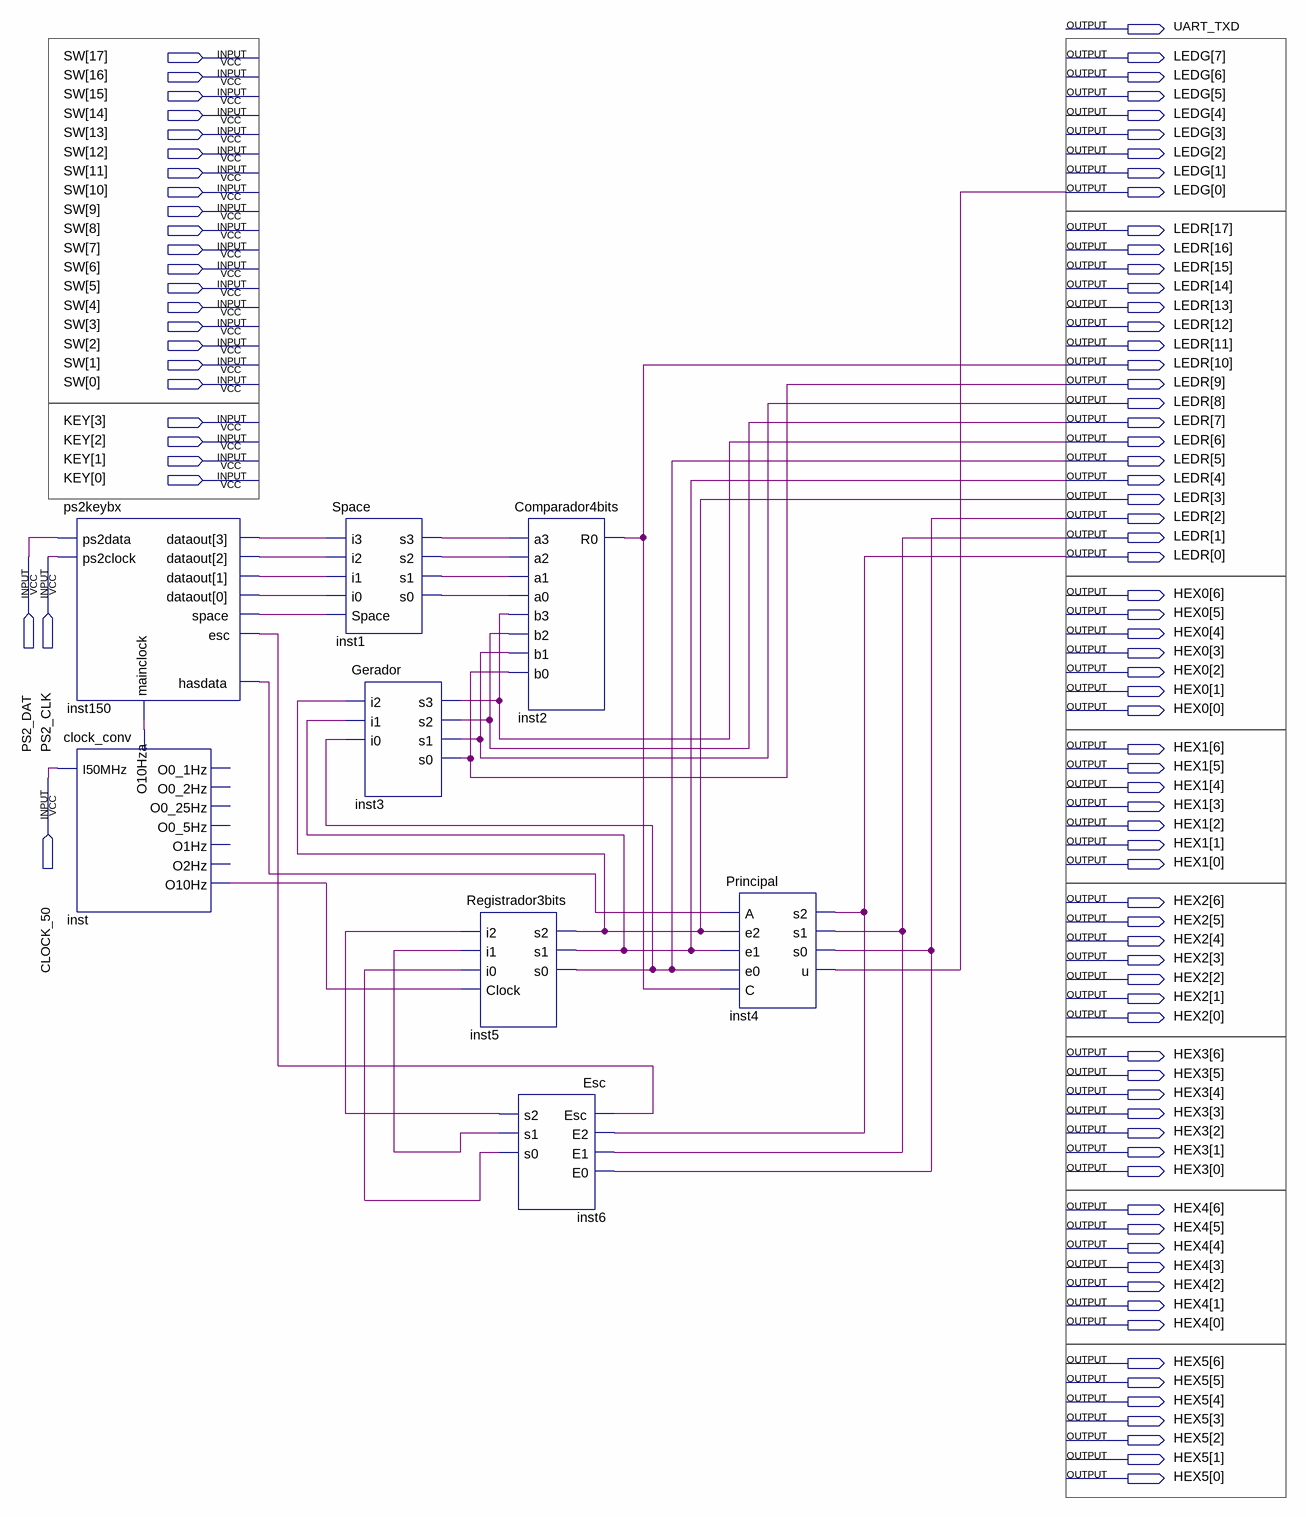
[diagram p0: schematic sheet]
// Quartus schematic ProjetoFinal2.bdf as structural Verilog: 8 symbols, 94 pins
module ProjetoFinal2 (
  input  [17:0] SW,
  input  [3:0] KEY,
  input  PS2_DAT,
  input  PS2_CLK,
  input  CLOCK_50,
  output UART_TXD,
  output [7:0] LEDG,
  output [17:0] LEDR,
  output [6:0] HEX0,
  output [6:0] HEX1,
  output [6:0] HEX2,
  output [6:0] HEX3,
  output [6:0] HEX4,
  output [6:0] HEX5
);

  wire inst1_s0, inst1_s1, inst1_s2, inst1_s3, inst6_s0, inst6_s1, inst6_s2, inst150_dataout,
       inst150_dataout_2, inst150_dataout_3, inst150_dataout_4, inst150_esc, inst150_hasdata, inst150_space,
       inst_o10hz, inst_o10hza;

  ps2keybx inst150 (
    .ps2data(PS2_DAT), .ps2clock(PS2_CLK), .mainclock(inst_o10hza),
    .dataout({inst150_dataout, inst150_dataout_2, inst150_dataout_3, inst150_dataout_4}),
    .hasdata(inst150_hasdata), .space(inst150_space), .esc(inst150_esc));
  clock_conv inst (
    .I50MHz(CLOCK_50), .O10Hz(inst_o10hz), .O10Hza(inst_o10hza));  // open: O0_1Hz, O0_2Hz, O0_25Hz, O0_5Hz, O1Hz, O2Hz
  Space inst1 (
    .i3(inst150_dataout), .i2(inst150_dataout_2), .i1(inst150_dataout_3), .i0(inst150_dataout_4),
    .Space(inst150_space), .s3(inst1_s3), .s2(inst1_s2), .s1(inst1_s1), .s0(inst1_s0));
  Gerador inst3 (.i2(LEDR[3]), .i1(LEDR[4]), .i0(LEDR[5]), .s3(LEDR[6]), .s2(LEDR[7]), .s1(LEDR[8]), .s0(LEDR[9]));
  Comparador4bits inst2 (
    .a3(inst1_s3), .a2(inst1_s2), .a1(inst1_s1), .a0(inst1_s0), .b3(LEDR[6]), .b2(LEDR[7]), .b1(LEDR[8]),
    .b0(LEDR[9]), .R0(LEDR[10]));
  Registrador3bits inst5 (
    .i2(inst6_s2), .i1(inst6_s1), .i0(inst6_s0), .Clock(inst_o10hz), .s2(LEDR[3]), .s1(LEDR[4]), .s0(LEDR[5]));
  Esc inst6 (.Esc(inst150_esc), .E2(LEDR[0]), .E1(LEDR[1]), .E0(LEDR[2]), .s2(inst6_s2), .s1(inst6_s1), .s0(inst6_s0));
  Principal inst4 (
    .A(inst150_hasdata), .e2(LEDR[3]), .e1(LEDR[4]), .e0(LEDR[5]), .C(LEDR[10]), .s2(LEDR[0]), .s1(LEDR[1]),
    .s0(LEDR[2]), .u(LEDG[0]));
endmodule
